# Altium schematic sheet Ref_CLK.SchDoc
size B; Organization: Altium Limited; Address1: L3, 12a Rodborough Rd; Address2: Frenchs Forest; Address3: NSW; Address4: Australia 2086
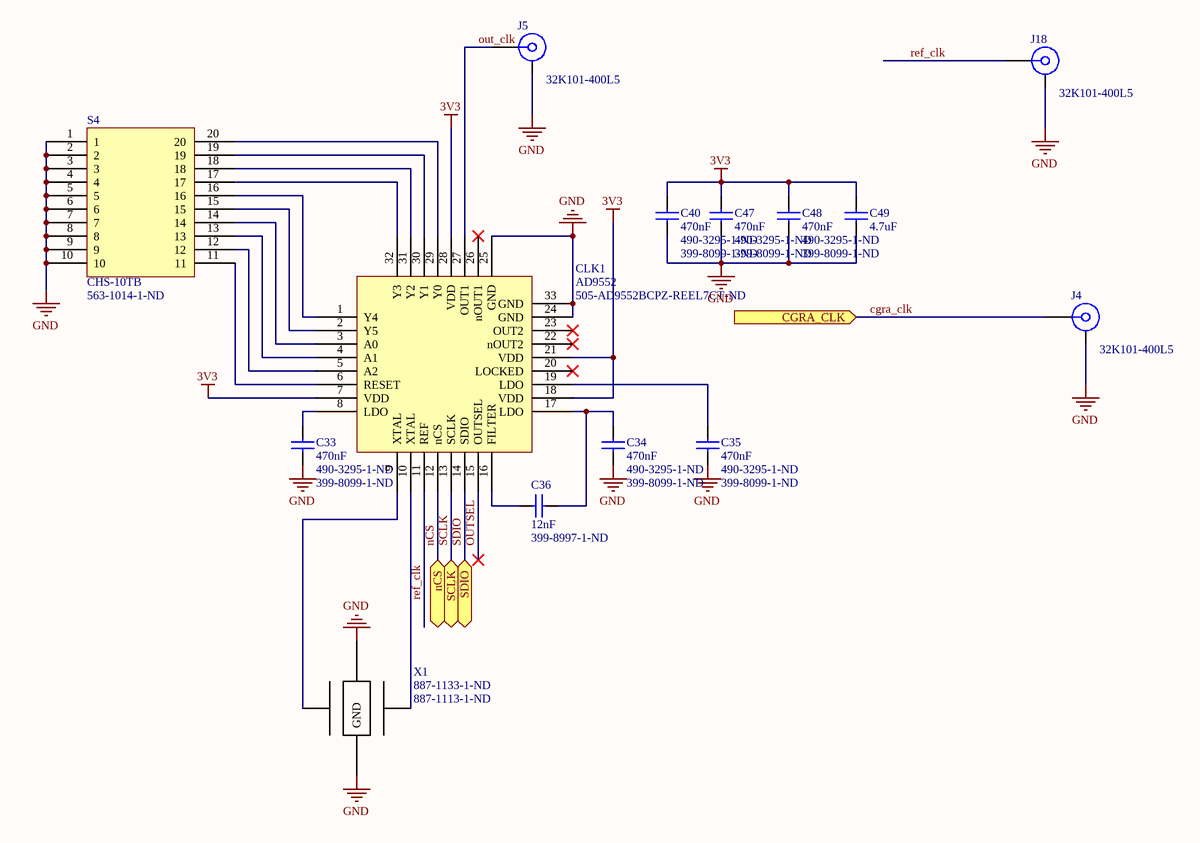
[diagram p0: Ref_CLK.SchDoc]

## Parts
C33  Capacitance: 470nF  Supplier Part Number 1: 490-3295-1-ND  Supplier Part Number 2: 399-8099-1-ND  [CAPC1005X06N]  (hidden comment: CAP_470nF_1608mm_0603mil_1)
C34  Capacitance: 470nF  Supplier Part Number 1: 490-3295-1-ND  Supplier Part Number 2: 399-8099-1-ND  [CAPC1005X06N]  (hidden comment: CAP_470nF_1608mm_0603mil_1)
C35  Capacitance: 470nF  Supplier Part Number 1: 490-3295-1-ND  Supplier Part Number 2: 399-8099-1-ND  [CAPC1005X06N]  (hidden comment: CAP_470nF_1608mm_0603mil_1)
C36  Capacitance: 12nF  Supplier Part Number 1: 399-8997-1-ND  [CAPC1005X06N]  (hidden comment: CAP_12nF_1608mm_0603mil)
C40  Capacitance: 470nF  Supplier Part Number 1: 490-3295-1-ND  Supplier Part Number 2: 399-8099-1-ND  [CAPC1005X06N]  (hidden comment: CAP_470nF_1608mm_0603mil_1)
C47  Capacitance: 470nF  Supplier Part Number 1: 490-3295-1-ND  Supplier Part Number 2: 399-8099-1-ND  [CAPC1005X06N]  (hidden comment: CAP_470nF_1608mm_0603mil_1)
C48  Capacitance: 470nF  Supplier Part Number 1: 490-3295-1-ND  Supplier Part Number 2: 399-8099-1-ND  [CAPC1005X06N]  (hidden comment: CAP_470nF_1608mm_0603mil_1)
C49  Capacitance: 4.7uF  [CAPC2012X14N]  (hidden comment: CAP_4.7uF_0805_25V)
CLK1  AD9552  Supplier Part Number 1: 505-AD9552BCPZ-REEL7CT-ND  [QFN50P500X500X80_HS-33N]
J4  32K101-400L5  [ROS-32K101-400L5_V]
J5  32K101-400L5  [ROS-32K101-400L5_V]
J18  32K101-400L5  [ROS-32K101-400L5_V]
S4  CHS-10TB  Supplier Part Number 1: 563-1014-1-ND  [SOIC127P800X250-20N]
X1  Supplier Part Number 1: 887-1133-1-ND  Supplier Part Number 2: 887-1113-1-ND  [7M-26.000MAAJ-T footprint]  (hidden comment: XTAL)

## Ports
CGRA_CLK (in), nCS (bidir), SCLK (bidir), SDIO (bidir)

## Nets
3V3: C40.1 C47.1 C48.1 C49.1 CLK1.7(VDD) CLK1.18(VDD) CLK1.21(VDD) CLK1.28(VDD)
GND: C33.2 C34.2 C35.2 C40.2 C47.2 C48.2 C49.2 CLK1.24(GND) CLK1.25(GND) CLK1.33(GND) J4.MH J5.MH J18.MH S4.1 S4.2 S4.3 S4.4 S4.5 S4.6 S4.7 S4.8 S4.9 S4.10 X1.2 X1.4(GND)
cgra_clk: J4.1 ; port CGRA_CLK
nCS: CLK1.12(nCS) ; port nCS
out_clk: CLK1.27(OUT1) J5.1
OUTSEL: CLK1.15(OUTSEL)
ref_clk: CLK1.11(REF) J18.1
SCLK: CLK1.13(SCLK) ; port SCLK
SDIO: CLK1.14(SDIO) ; port SDIO
NetC33_1: C33.1 CLK1.8(LDO)
NetC34_1: C34.1 C36.2 CLK1.17(LDO)
NetC35_1: C35.1 CLK1.19(LDO)
NetC36_1: C36.1 CLK1.16(FILTER)
NetCLK1_1: CLK1.1(Y4) S4.16
NetCLK1_2: CLK1.2(Y5) S4.15
NetCLK1_3: CLK1.3(A0) S4.14
NetCLK1_4: CLK1.4(A1) S4.13
NetCLK1_5: CLK1.5(A2) S4.12
NetCLK1_6: CLK1.6(RESET) S4.11
NetCLK1_9: CLK1.9(XTAL) X1.1(XO)
NetCLK1_10: CLK1.10(XTAL) X1.3(XI)
NetCLK1_29: CLK1.29(Y0) S4.20
NetCLK1_30: CLK1.30(Y1) S4.19
NetCLK1_31: CLK1.31(Y2) S4.18
NetCLK1_32: CLK1.32(Y3) S4.17

Not connected (* = marked no-connect by the designer): CLK1 20(LOCKED)* 22(nOUT2)* 23(OUT2)* 26(nOUT1)*

## Notes on the sheet
- Title
- Size:
- Date:
- B
- Number:
- Time:
- Revision:
- Sheet
- of
- File:

## Library data of the parts
C33-C35 C40 C47 C48 = CAP_470nF_1608mm_0603mil_1: 0.47uF Capacitor; Manufacturer: Murata; Manufacturer Part Number: GRM155R61E225ME15D; Voltage Rating: 25V; Tolerance: 20%; Dielectric: X5R; ComponentLink1URL: http://search.murata.co.jp/Ceramy/image/img/A01X/G101/ENG/GRM0335C1E120JA01-01.pdf; ComponentLink1Description: http://search.murata.co.jp/Ceramy/image/img/A01X/G101/ENG/GRM0335C1E120JA01-01.pdf; ComponentLink2URL: http://search.murata.co.jp/Ceramy/image/img/A01X/partnumbering_e_01.pdf; ComponentLink2Description: http://search.murata.co.jp/Ceramy/image/img/A01X/partnumbering_e_01.pdf; ComponentLink3URL: http://www1.futureelectronics.com/doc/SAMSUNG/CL03A104KQ3NNNC.pdf; ComponentLink3Description: http://www1.futureelectronics.com/doc/SAMSUNG/CL03A104KQ3NNNC.pdf; ComponentLink4URL: https://www.distrelec.biz/Web/Downloads/_e/ng/MLCC_CatalogDownload2013_ENG.pdf?mime=application%2Fpdf; ComponentLink4Description: https://www.distrelec.biz/Web/Downloads/_e/ng/MLCC_CatalogDownload2013_ENG.pdf?mime=application%2Fpdf; ComponentLink5URL: https://www.verical.com/server-webapp/html/getDatasheet?partID=355266; ComponentLink5Description: https://www.verical.com/server-webapp/html/getDatasheet?partID=355266; ComponentLink6URL: http://psearch.murata.com/capacitor/product/GCM155R71H103KA55%23.pdf; ComponentLink6Description: http://psearch.murata.com/capacitor/product/GCM155R71H103KA55%23.pdf; ComponentLink7URL: https://www.verical.com/server-webapp/html/getDatasheet?partID=27433; ComponentLink7Description: https://www.verical.com/server-webapp/html/getDatasheet?partID=27433; ComponentLink8URL: http://psearch.en.murata.com/capacitor/product/GCM155R71H103KA55%23.pdf; ComponentLink8Description: http://psearch.en.murata.com/capacitor/product/GCM155R71H103KA55%23.pdf; ComponentLink9URL: http://search.murata.co.jp/Ceramy/image/img/A01X/partnumbering_e_02.pdf; ComponentLink9Description: http://search.murata.co.jp/Ceramy/image/img/A01X/partnumbering_e_02.pdf; ComponentLink10URL: http://uk.rs-online.com/webdocs/0ef9/0900766b80ef92d0.pdf; ComponentLink10Description: http://uk.rs-online.com/webdocs/0ef9/0900766b80ef92d0.pdf; Stock 1: 100000; Pricing 1: 1=0.34, 10=0.23, 100=0.1163, 500=0.0796, 1000=0.07041, 2500=0.06735, 5000=0.06123 (USD); Mount: Surface Mount; Case/Package: 0402; Weight: 0.000212oz; Case Code (Metric): 1005; Case Code (Imperial): 0402; Min Operating Temperature: -55°C; Max Operating Temperature: 85°C; Packaging: Tape and Reel; Termination: SMD/SMT; Voltage Rating (DC): 25V; Package Quantity: 10000; Length: 0.039inch; Height: 0.5mm; Width: 0.02inch; Thickness: 0.022inch; Supplier 1: Digi-Key; Supplier 2: Digi-Key
C36 = CAP_12nF_1608mm_0603mil: Multilayer Ceramic Capacitors MLCC - SMD/SMT 0402 2.2uF 25volts *Derate Voltage/Temp; Manufacturer: Murata; Manufacturer Part Number: GRM155R61E225ME15D; Voltage Rating: 25V; Tolerance: 20%; Dielectric: X5R; ComponentLink1URL: http://search.murata.co.jp/Ceramy/image/img/A01X/G101/ENG/GRM0335C1E120JA01-01.pdf; ComponentLink1Description: http://search.murata.co.jp/Ceramy/image/img/A01X/G101/ENG/GRM0335C1E120JA01-01.pdf; ComponentLink2URL: http://search.murata.co.jp/Ceramy/image/img/A01X/partnumbering_e_01.pdf; ComponentLink2Description: http://search.murata.co.jp/Ceramy/image/img/A01X/partnumbering_e_01.pdf; ComponentLink3URL: http://www1.futureelectronics.com/doc/SAMSUNG/CL03A104KQ3NNNC.pdf; ComponentLink3Description: http://www1.futureelectronics.com/doc/SAMSUNG/CL03A104KQ3NNNC.pdf; ComponentLink4URL: https://www.distrelec.biz/Web/Downloads/_e/ng/MLCC_CatalogDownload2013_ENG.pdf?mime=application%2Fpdf; ComponentLink4Description: https://www.distrelec.biz/Web/Downloads/_e/ng/MLCC_CatalogDownload2013_ENG.pdf?mime=application%2Fpdf; ComponentLink5URL: https://www.verical.com/server-webapp/html/getDatasheet?partID=355266; ComponentLink5Description: https://www.verical.com/server-webapp/html/getDatasheet?partID=355266; ComponentLink6URL: http://psearch.murata.com/capacitor/product/GCM155R71H103KA55%23.pdf; ComponentLink6Description: http://psearch.murata.com/capacitor/product/GCM155R71H103KA55%23.pdf; ComponentLink7URL: https://www.verical.com/server-webapp/html/getDatasheet?partID=27433; ComponentLink7Description: https://www.verical.com/server-webapp/html/getDatasheet?partID=27433; ComponentLink8URL: http://psearch.en.murata.com/capacitor/product/GCM155R71H103KA55%23.pdf; ComponentLink8Description: http://psearch.en.murata.com/capacitor/product/GCM155R71H103KA55%23.pdf; ComponentLink9URL: http://search.murata.co.jp/Ceramy/image/img/A01X/partnumbering_e_02.pdf; ComponentLink9Description: http://search.murata.co.jp/Ceramy/image/img/A01X/partnumbering_e_02.pdf; ComponentLink10URL: http://uk.rs-online.com/webdocs/0ef9/0900766b80ef92d0.pdf; ComponentLink10Description: http://uk.rs-online.com/webdocs/0ef9/0900766b80ef92d0.pdf; Stock 1: 100000; Pricing 1: 1=0.34, 10=0.23, 100=0.1163, 500=0.0796, 1000=0.07041, 2500=0.06735, 5000=0.06123 (USD); Mount: Surface Mount; Case/Package: 0402; Weight: 0.000212oz; Case Code (Metric): 1005; Case Code (Imperial): 0402; Min Operating Temperature: -55°C; Max Operating Temperature: 85°C; Packaging: Tape and Reel; Termination: SMD/SMT; Voltage Rating (DC): 25V; Package Quantity: 10000; Length: 0.039inch; Height: 0.5mm; Width: 0.02inch; Thickness: 0.022inch; Supplier 1: Digi-Key
C49 = CAP_4.7uF_0805_25V: Cap Ceramic 4.7uF 25V X5R 10% SMD 0805 85C Cardboard T/R; Manufacturer: Samsung; Manufacturer Part Number: CL21A475KACLRNC; Supplier 1: Digi-Key; Stock 1: 10785; Pricing 1: 1=0.25, 10=0.171, 100=0.0867, 500=0.05932, 1000=0.05247 (USD); Mount: Surface Mount; Case/Package: 0805; Case Code (Metric): 2012; Case Code (Imperial): 0805; Min Operating Temperature: -55°C; Max Operating Temperature: 85°C; Package Quantity: 1; Packaging: Tape and Reel; Tolerance: 10%; Voltage Rating: 25V; Dielectric: X5R; Length: 2mm; Height: 0.85mm; Width: 0.049inch; Thickness: 0.037inch; Depth: 1.25mm; Radiation Hardening: No; ComponentLink1URL: http://www.samsungsem.com/kr/support/product-search/mlcc/CL21A475KACLRNC.jsp; ComponentLink1Description: http://www.samsungsem.com/kr/support/product-search/mlcc/CL21A475KACLRNC.jsp; Supplier Part Number 1: 1276-2415-1-ND
J4 J5 J18 = 32K101-400L5: SMA Straight Jack, Up to 18 GHz, -55 to 155 degC; Design Note: Footprint in library is a generic example - only application specific footprint delivers High Performance; DatasheetVersion: a00; PackageVersion: a00; PackageReference: 32K101-400L5; PackageDescription: SMA Straight Jack, 6.35 x 6.35 x 9.5 mm; Mounting Technology: Through Hole; PartNumber: 32K101-400L5; ComponentLink1Description: Manufacturer URL; ComponentLink1URL: http://www.rosenberger.de; ComponentLink2Description: Datasheet; ComponentLink2URL: http://rosenberger.de/ok/images/documents/db/32K101-400L5.pdf; ComponentLink3Description: Package Specification; ComponentLink3URL: http://rosenberger.de/ok/images/documents/db/32K101-400L5.pdf; ComponentLink4Description: Series Overview / Design Note; ComponentLink4URL: http://rosenberger.de/ok/images/documents/spez/32.pdf; ComponentLink5Description: Webshop / RFQ; ComponentLink5URL: http://www.rosenberger.com/en/contact/sales/
X1 = XTAL: Crystal; Manufacturer: Abracon; Manufacturer Part Number: ABS07-120-32.768KHZ-T; Tolerance: 20ppm; Frequency: 32.768kHz; Load Capacitance: 6pF; ESR (Equivalent Series Resistance): 55kR; Series Resistance: 60kR; ComponentLink1URL: https://www.verical.com/server-webapp/html/getDatasheet?partID=722402; ComponentLink1Description: https://www.verical.com/server-webapp/html/getDatasheet?partID=722402; ComponentLink2URL: https://abracon.com/Support/PackageDrawing/Resonators/ABS07-120.PDF; ComponentLink2Description: https://abracon.com/Support/PackageDrawing/Resonators/ABS07-120.PDF; ComponentLink3URL: http://www.mouser.com/ds/2/3/ABS07-120-32.768kHz-T-218607.pdf; ComponentLink3Description: http://www.mouser.com/ds/2/3/ABS07-120-32.768kHz-T-218607.pdf; Stock 1: 222072; Pricing 1: 1=0.57, 10=0.473, 50=0.4258, 100=0.3784, 500=0.35948, 1000=0.30272 (USD); Mount: Surface Mount; Case/Package: SMD/SMT; Number of Pins: 2; Min Operating Temperature: -40°C; Max Operating Temperature: 85°C; Frequency Tolerance: 20ppm; Packaging: Tape and Reel; Package Quantity: 3000; Termination: SMD/SMT; Length: 3.2mm; Height: 0.035inch; Width: 0.061inch; Depth: 1.5mm; Radiation Hardening: No; REACH SVHC: No SVHC; Lead Free: Lead Free; Supplier 1: Digi-Key; Supplier 2: Digi-Key
CLK1 = AD9552: Supplier 1: Digi-Key
S4 = CHS-10TB: Supplier 1: Digi-Key